# EasyEDA Pro project 主驱一体(省高校).epro

# Schematic Schematic4_1
Create Date: 2024-09-04; Page Name: P1; Project Name: 麦轮小车主控板; Schematic Name: Schematic4_1; Update Date: 2024-09-04; Company: 嘉立创EDA; Page Size: A4; Version: V1.0
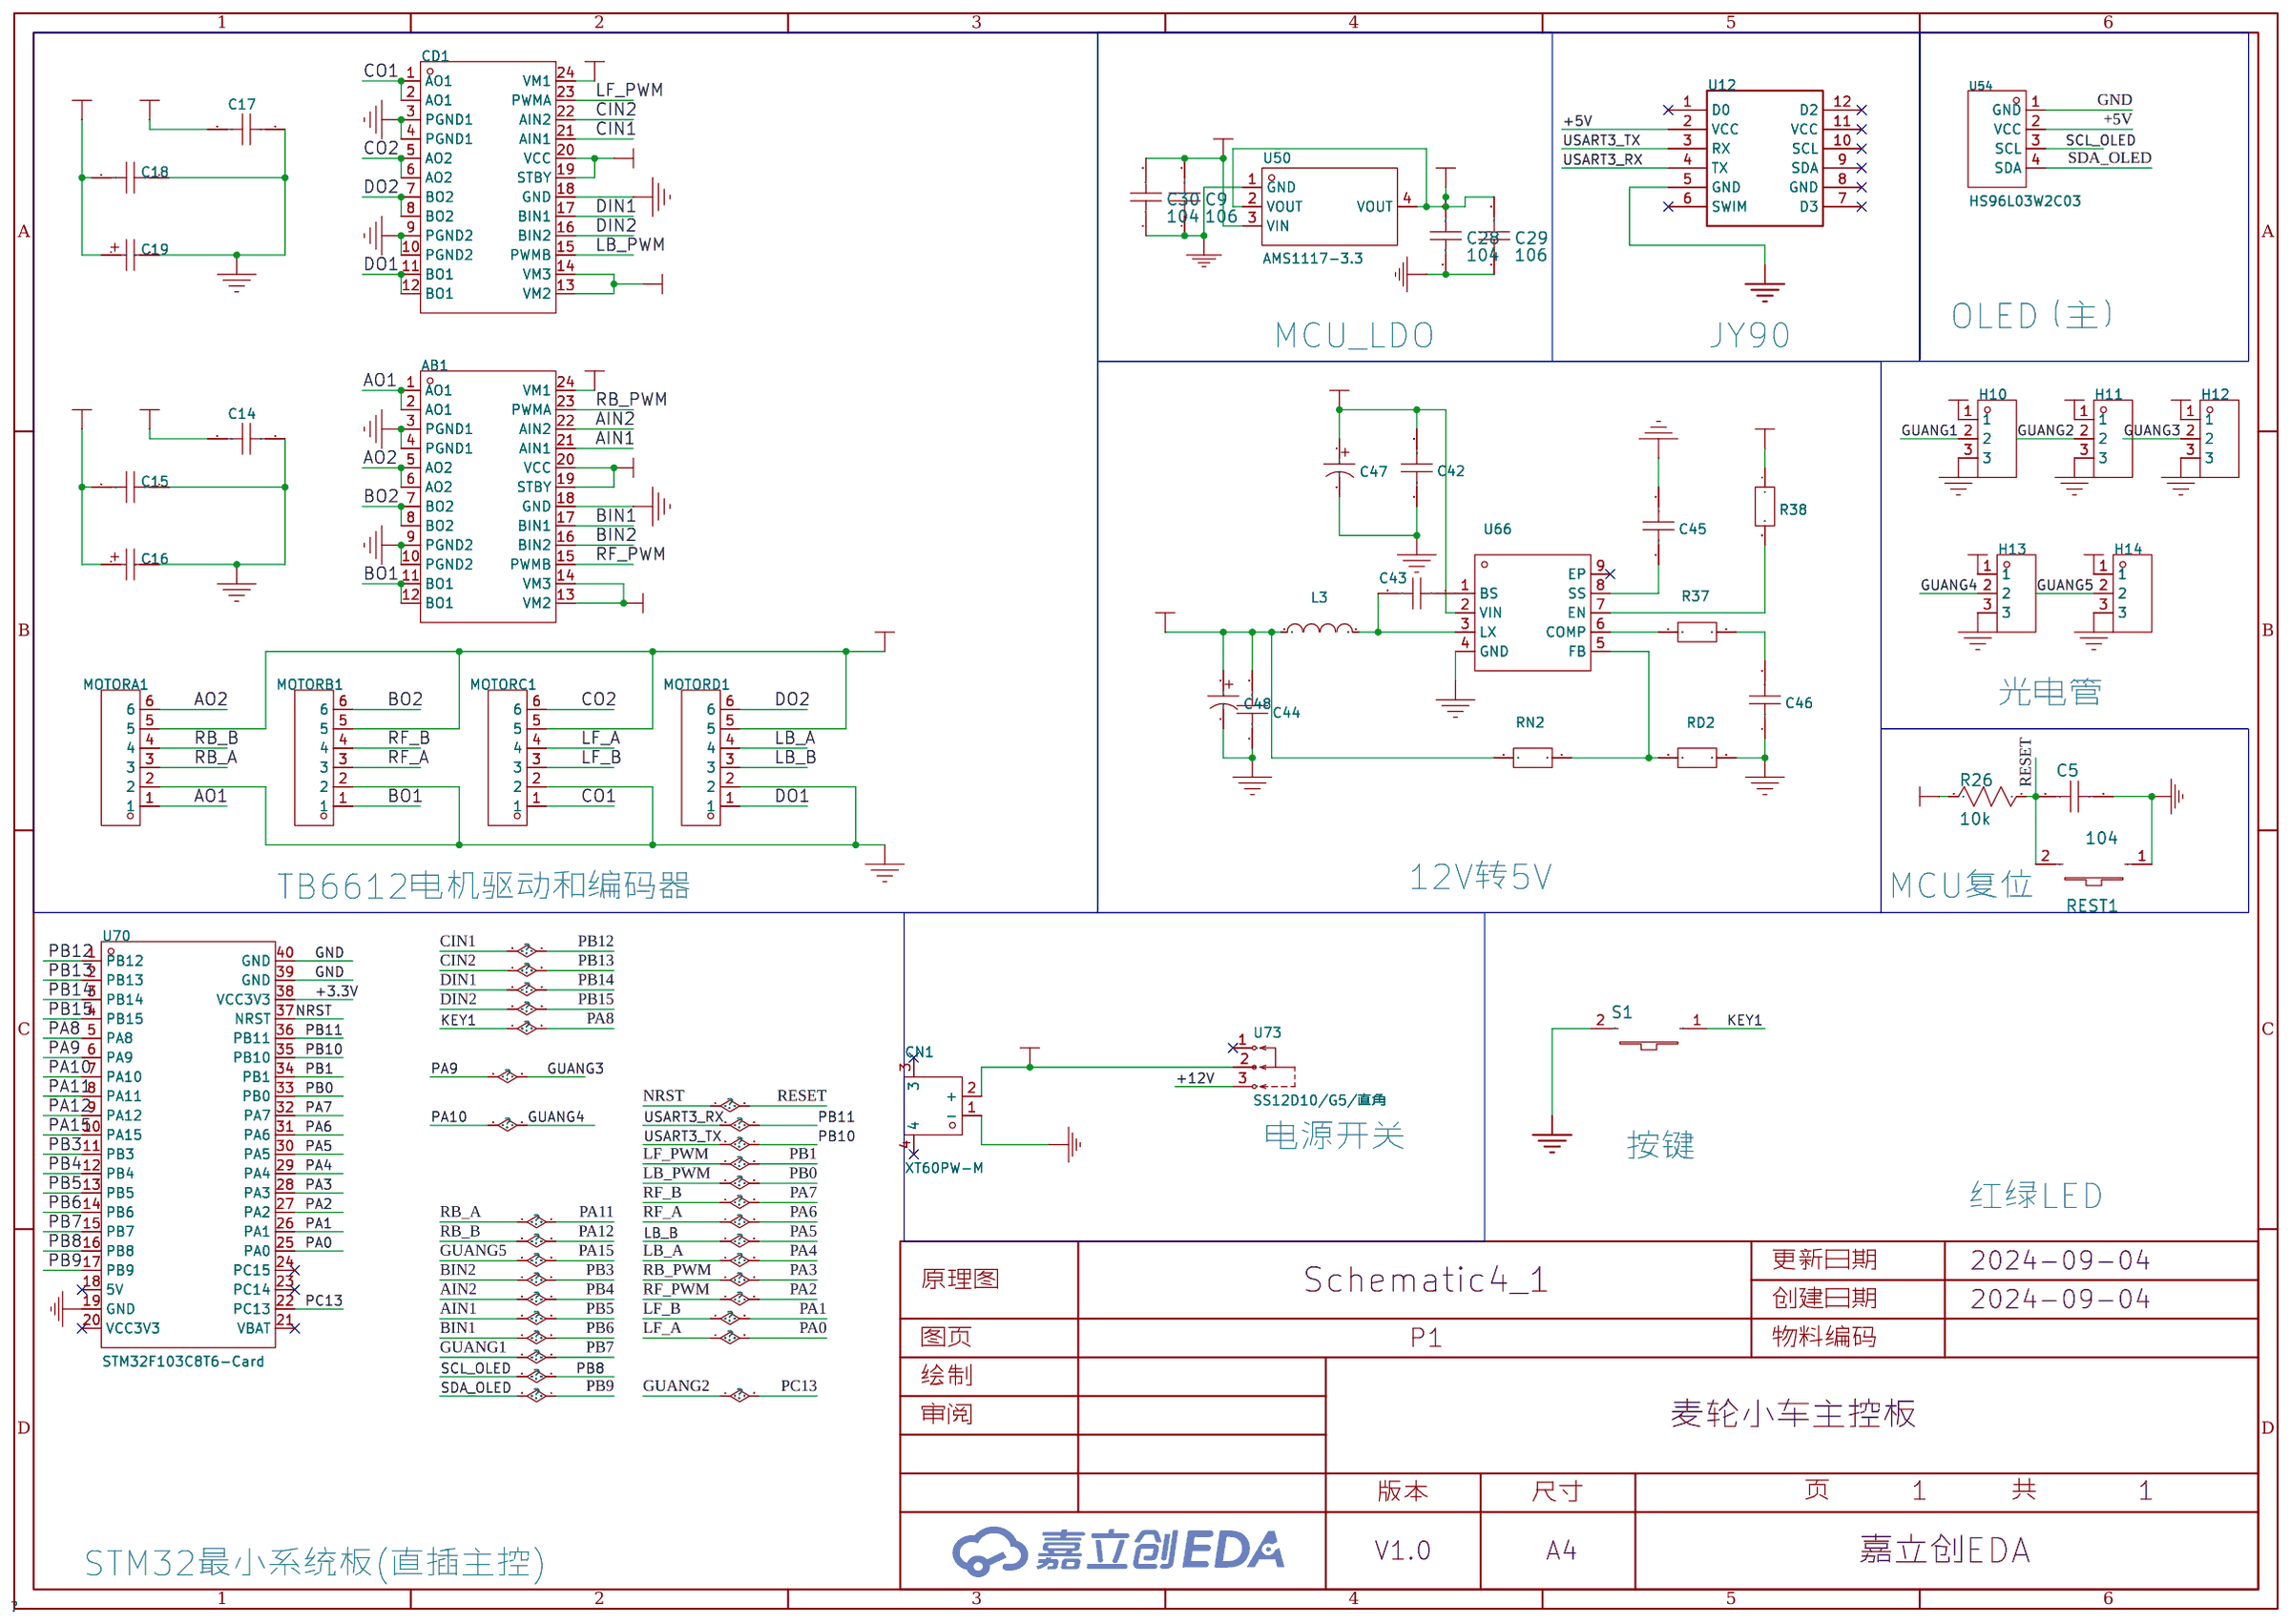
[diagram p0: schematic sheet]

## Parts
AB1  TB6612FNG(O,C,8,EL  [SSOP-24_L8.4-W5.8-P0.65-LS7.8-BL]
C5  104  [c0805]
C9  106  [c0805]
C14  100nF  [C0603]
C15  100nF  [C0603]
C16  10uF  [CAP-SMD_L3.5-W2.8-R-RD]
C17  100nF  [C0603]
C18  100nF  [C0603]
C19  10uF  [CAP-SMD_L3.5-W2.8-R-RD]
C28  104  [c0805]
C29  106  [c0805]
C30  104  [c0805]
C42  0.1uF  [c0805]
C43  10nF  [c0805]
C44  0.1uF  [c0805]
C45  0.1uF  [c0805]
C46  1.5nF  [c0805]
C47  100uF  [cap-smd_bd6.3-l6.6-w6.6-fd]
C48  100uF  [cap-smd_bd6.3-l6.6-w6.6-fd]
CD1  TB6612FNG(O,C,8,EL  [SSOP-24_L8.4-W5.8-P0.65-LS7.8-BL]
CN1  XT60PW-M  [CONN-TH_XT60PW-M]
H10  -  [HDR-TH_3P-P2.54-V-F]
H11  -  [HDR-TH_3P-P2.54-V-F]
H12  -  [HDR-TH_3P-P2.54-V-F]
H13  -  [HDR-TH_3P-P2.54-V-F]
H14  -  [HDR-TH_3P-P2.54-V-F]
L3  10uH  [ind-smd_l6.6-w6.6_mcw-06xx]
MOTORA1  X8821WR-06S-N0SN  [CONN-TH_6P-P2.50_X8821WR-06S-N2SN]
MOTORB1  X8821WR-06S-N0SN  [CONN-TH_6P-P2.50_X8821WR-06S-N2SN]
MOTORC1  X8821WR-06S-N0SN  [CONN-TH_6P-P2.50_X8821WR-06S-N2SN]
MOTORD1  X8821WR-06S-N0SN  [CONN-TH_6P-P2.50_X8821WR-06S-N2SN]
R26  10k  [r0805]
R37  5k  [r0805]
R38  100k  [r0805]
RD2  9.1k  [r0805]
REST1  Switch3x4x2  [KEY-SMD_2P-L6.2-W3.6-LS8.0]
RN2  39k  [r0805]
S1  Switch3x4x2  [KEY-SMD_2P-L6.2-W3.6-LS8.0]
U12  MPU6050(JY6X)  [维特陀螺仪]
U50  AMS1117-3.3  [SOT-223-3_L6.5-W3.4-P2.30-LS7.0-BR]
U54  HS96L03W2C03  [OLED-TH_L27.8-W27.2-P2.54_C9900033791]
U66  APW7301KAI-TRG  [sop-8_l4.9-w3.9-p1.27-ls6.0-bl-ep]
U70  STM32F103C8T6-Card  [CONN-TH_L53.3-W22.9_STM32F103C8T6-CARD]
U73  SS12D10/G5/直角  [SW-TH_SHOU-HAN_SS12D10G4]

## Library data of the parts
AB1 CD1 = TB6612FNG(O,C,8,EL: 双直流电机驱动器集成电路; Supplier Part: C88224; Manufacturer: TOSHIBA(东芝); Supplier Footprint: SSOP-24-208mil; JLCPCB Part Class: 扩展库; Datasheet: https://atta.szlcsc.com/upload/public/pdf/source/20171128/C141517_15118625624231147036.pdf; Supplier: LCSC
C5 C28 C30 = 104
C9 = 105
C14 C15 C17 C18 = 100nF: 容值:100nF;精度:±10%;额定电压:50V;材质(温度系数):X7R;; Supplier: LCSC; Manufacturer: SAMSUNG(三星); Manufacturer Part: CL10B104KB8NNNC; Supplier Part: C1591; JLCPCB Part Class: 扩展库; LCSC Part Name: 100nF ±10% 50V; Supplier Footprint: 0603; Datasheet: https://atta.szlcsc.com/upload/public/pdf/source/20160218/1457707763339.pdf; Tolerance: ±10%; Voltage Rated: 50V; Temperature Coefficient: X7R; Origin Footprint 1: CL10B104KB8NNNC
C16 C19 = 10uF: 容值:10uF;精度:±10%;额定电压:25V;等效串联电阻:2.5Ω@100kHz;; LCSC Part Name: 10uF ±10% 25V; Supplier Part: C7194; Manufacturer: Kyocera AVX; Manufacturer Part: TAJB106K025RNJ; Supplier Footprint: CASE-B-3528; JLCPCB Part Class: 扩展库; Datasheet: https://atta.szlcsc.com/upload/public/pdf/source/20160107/1457707750344.pdf; Supplier: LCSC; Tolerance: ±10%; Rated Voltage: 25V; Equivalent Series Resistance(ESR): 2.5Ω@100kHz; Operating Temperature: -55℃~+125℃; Origin Footprint 1: TAJB106K025RNJ
C29 = 106
C42 C44 C45 = 0.1uF: Supplier Part: C49678; Supplier: LCSC; Manufacturer Part: CC0805KRX7R9BB104; Manufacturer: YAGEO
C43 = 10nF: Supplier Part: C83170; Supplier: LCSC; Manufacturer Part: CC0805KRX7R9BB103; Manufacturer: YAGEO
C46 = 1.5nF: Supplier Part: C282745; Supplier: LCSC; Manufacturer Part: TCC0805X7R152K500DT; Manufacturer: CCTC
C47 C48 = 100uF: Supplier: LCSC; Manufacturer: ROQANG; Manufacturer Part: RVT1E101M0607; Supplier Part: C72477
CN1 = XT60PW-M: 类别:-;类型1:-;; LCSC Part Name: AMASS(艾迈斯)航模插头xt60连接器150公母对接pw锂电池公头 板插卧式XT60PW-M; Supplier Part: C98732; Manufacturer: AMASS(艾迈斯); JLCPCB Part Class: 扩展库; Datasheet: https://atta.szlcsc.com/upload/public/pdf/source/20240118/44A3DCFF53BE25DC65378AFFB21277A4.pdf; Supplier: LCSC; Brand: 艾迈斯; Type: 卧式插头; Colour: 黄色; InterfaceType: 公头
H10-H14 = HDR-F_2.54_1x3P: Supplier Part: C541850; Supplier Footprint: 插件
L3 = 10uH: Supplier: LCSC; Manufacturer: Hk-hotline; Manufacturer Part: MCW-0630-100-N2; Supplier Part: C169308
MOTORA1 MOTORB1 MOTORC1 MOTORD1 = X8821WR-06S-N0SN: 插针结构:1x6P;间距:2.5mm;安装方式:弯插;参考系列:XH;总PIN数:6P;排数:1;每排PIN数:6;行距:-;额定电流:3A;触头材质:黄铜;触头镀层:锡;工作温度范围:-;; LCSC Part Name: 1x6P 间距:2.5mm 弯插 系列:XH; Supplier Part: C388743; Manufacturer: XKB Connection(中国星坤); Supplier Footprint: 弯插,P=2.54mm; JLCPCB Part Class: 扩展库; Datasheet: https://atta.szlcsc.com/upload/public/pdf/source/20211009/984C14C41D2B1156BCF8EEF5D296E395.pdf; Supplier: LCSC; Pins Structure: 1x6P; Pitch: 2.5mm; Mounting Style: 弯插; Reference Series: XH; Number of Pins: 6P; Number of Rows: 1; Number of PINs Per Row: 6; Current Rating (Max): 3A; Contact Material: 黄铜; Contact Plating: 锡
R26 = 10k
R37 = 5k: Supplier Part: C332873; Supplier: LCSC; Manufacturer Part: RTT055001FTP; Manufacturer: RALEC
R38 = 100k: Supplier Part: C118847; Supplier: LCSC; Manufacturer Part: RS-05K1003FT; Manufacturer: FH
RD2 = 9.1k: Supplier Part: C286615; Supplier: LCSC; Manufacturer Part: RS-05K9101FT; Manufacturer: Guangdong Fenghua Advanced Tech
REST1 S1 = Switch3x4x2: Supplier: LCSC; Manufacturer: ReliaPro; Supplier Part: C26638
RN2 = 39k: Supplier Part: C25826; Supplier: LCSC; Manufacturer Part: 0805W8F3902T5E; Manufacturer: UniOhm
U12 = 维特陀螺仪
U50 = AMS1117-3.3_C6186: 输出类型:固定;输出极性:正;输出通道数:1;最大输入电压:-;输出电压:3.3V;压差:1.3V@(800mA);静态电流(地电流):-;输出电流:1A;电源纹波抑制比(PSRR):72dB@(120Hz);噪声:-;特性:-;工作温度:-;; LCSC Part Name: 正 Vout=3.3V 1A 72dB@(120Hz); Supplier Part: C6186; Manufacturer: AMS; Supplier Footprint: SOT-223-3; JLCPCB Part Class: 基础库; Datasheet: https://atta.szlcsc.com/upload/public/pdf/source/20180727/C6186_7A095716F0823C02F1997A905E26C086.pdf; Supplier: LCSC; Output Type: 固定; Output Polarity: 正; Number of Outputs: 1; Output Voltage: 3.3V; Dropout Voltage: 1.3V@(800mA); Output Current: 1A; Power Supply Rejection Ratio (PSRR): 72dB@(120Hz)
U54 = SPI-0.96OLED: 尺寸(inch)：0.96寸 0.96apos; 像素分辨率：128x64 128*64主控芯片：SSD1315 接口类型：I2C 外形:27.3*27.8；IIC/3SPI/4SPI串口通讯,工作温度范围-40℃—+70℃。4PIN黑底白光。; LCSC Part Name: 0.96寸OLED显示屏窄白光IIC; Supplier Part: C5248080; Manufacturer: HS(汉昇); JLCPCB Part Class: 扩展库; Datasheet: https://atta.szlcsc.com/upload/public/pdf/source/20230627/763D01F79A90007632F098068C7C8AD9.pdf; Supplier: LCSC
U66 = APW7301KAI-TRG: Supplier: LCSC; Manufacturer: ANPEC; Supplier Part: C115136; JLCPCB Part Class: Extend
U70 = STM32F103C8T6-Card: Supplier Part: C9900077949; Supplier Footprint: 插件; JLCPCB Part Class: Extended Part; Supplier: LCSC
U73 = SS12D10/G5/直角: Supplier Part: C9900029541; Supplier Footprint: THrough hole; JLCPCB Part Class: 扩展库; Supplier: LCSC

## Nets
+3.3V: C28.2 C29.2 R26.2 U50.2(VOUT) U50.4(VOUT) U70.38(VCC3V3)
+5V: AB1.19(STBY) AB1.20(VCC) C9.2 C14.2 C17.2 C30.2 C44.2 C48.1 CD1.19(STBY) CD1.20(VCC) H10.1 H11.1 H12.1 H13.1 H14.1 L3.1 MOTORA1.5 MOTORB1.5 MOTORC1.5 MOTORD1.5 RN2.2 U12.2(VCC) U50.3(VIN) U54.2(VCC)
+12V: AB1.13(VM2) AB1.14(VM3) AB1.24(VM1) C15.2 C16.1 C18.2 C19.1 C42.2 C47.1 CD1.13(VM2) CD1.14(VM3) CD1.24(VM1) R38.1 U66.2(VIN) U73.3
GND: AB1.3(PGND1) AB1.4(PGND1) AB1.9(PGND2) AB1.10(PGND2) AB1.18(GND) C5.1 C9.1 C14.1 C15.1 C16.2 C17.1 C18.1 C19.2 C28.1 C29.1 C30.1 C42.1 C44.1 C45.2 C46.1 C47.2 C48.2 CD1.3(PGND1) CD1.4(PGND1) CD1.9(PGND2) CD1.10(PGND2) CD1.18(GND) CN1.1(-) H10.3 H11.3 H12.3 H13.3 H14.3 MOTORA1.2 MOTORB1.2 MOTORC1.2 MOTORD1.2 RD2.2 REST1.1 S1.2 U12.5(GND) U50.1(GND) U54.1(GND) U66.4(GND) U70.19(GND) U70.39(GND) U70.40(GND)
VCC: CN1.2(+) U73.2
AIN1: AB1.21(AIN1) U70.13(PB5)
AIN2: AB1.22(AIN2) U70.12(PB4)
AO1: AB1.1(AO1) AB1.2(AO1) MOTORA1.1
AO2: AB1.5(AO2) AB1.6(AO2) MOTORA1.6
BIN1: AB1.17(BIN1) U70.14(PB6)
BIN2: AB1.16(BIN2) U70.11(PB3)
BO1: AB1.11(BO1) AB1.12(BO1) MOTORB1.1
BO2: AB1.7(BO2) AB1.8(BO2) MOTORB1.6
CIN1: CD1.21(AIN1) U70.1(PB12)
CIN2: CD1.22(AIN2) U70.2(PB13)
CO1: CD1.1(AO1) CD1.2(AO1) MOTORC1.1
CO2: CD1.5(AO2) CD1.6(AO2) MOTORC1.6
DIN1: CD1.17(BIN1) U70.3(PB14)
DIN2: CD1.16(BIN2) U70.4(PB15)
DO1: CD1.11(BO1) CD1.12(BO1) MOTORD1.1
DO2: CD1.7(BO2) CD1.8(BO2) MOTORD1.6
GUANG1: H10.2 U70.15(PB7)
GUANG2: H11.2 U70.22(PC13)
GUANG3: H12.2 U70.6(PA9)
GUANG4: H13.2 U70.7(PA10)
GUANG5: H14.2 U70.10(PA15)
KEY1: S1.1 U70.5(PA8)
LB_A: MOTORD1.4 U70.29(PA4)
LB_B: MOTORD1.3 U70.30(PA5)
LB_PWM: CD1.15(PWMB) U70.33(PB0)
LF_A: MOTORC1.4 U70.25(PA0)
LF_B: MOTORC1.3 U70.26(PA1)
LF_PWM: CD1.23(PWMA) U70.34(PB1)
NRST: C5.2 R26.1 REST1.2 U70.37(NRST)
PA2: AB1.15(PWMB) U70.27(PA2)
PA3: AB1.23(PWMA) U70.28(PA3)
PA6: MOTORB1.3 U70.31(PA6)
PA7: MOTORB1.4 U70.32(PA7)
PA11: MOTORA1.3 U70.8(PA11)
PA12: MOTORA1.4 U70.9(PA12)
PB8: U54.3(SCL) U70.16(PB8)
PB9: U54.4(SDA) U70.17(PB9)
PB10: U12.3(RX) U70.35(PB10)
PB11: U12.4(TX) U70.36(PB11)
$1N6371: C43.2 L3.2 U66.3(LX)
$1N6375: C43.1 U66.1(BS)
$1N6383: RD2.1 RN2.1 U66.5(FB)
$1N6390: C45.1 U66.8(SS)
$1N6393: R37.2 U66.6(COMP)
$1N6395: C46.2 R37.1
$1N6398: R38.2 U66.7(EN)

Not connected (* = marked no-connect by the designer): CN1 3* 4*; U12 1(D0)* 6(SWIM)* 7(D3)* 8(GND)* 9(SDA)* 10(SCL)* 11(VCC)* 12(D2)*; U66 9(EP)*; U70 18(5V)* 20(VCC3V3)* 21(VBAT)* 23(PC14)* 24(PC15)*; U73 1*

## Notes on the sheet
- OLED（主）
- MCU_LDO
- JY90
- 光电管
- MCU复位
- TB6612电机驱动和编码器
- 12V转5V
- 电源开关
- 按键
- 红绿LED
- STM32最小系统板(直插主控)

# Board PCB23_1
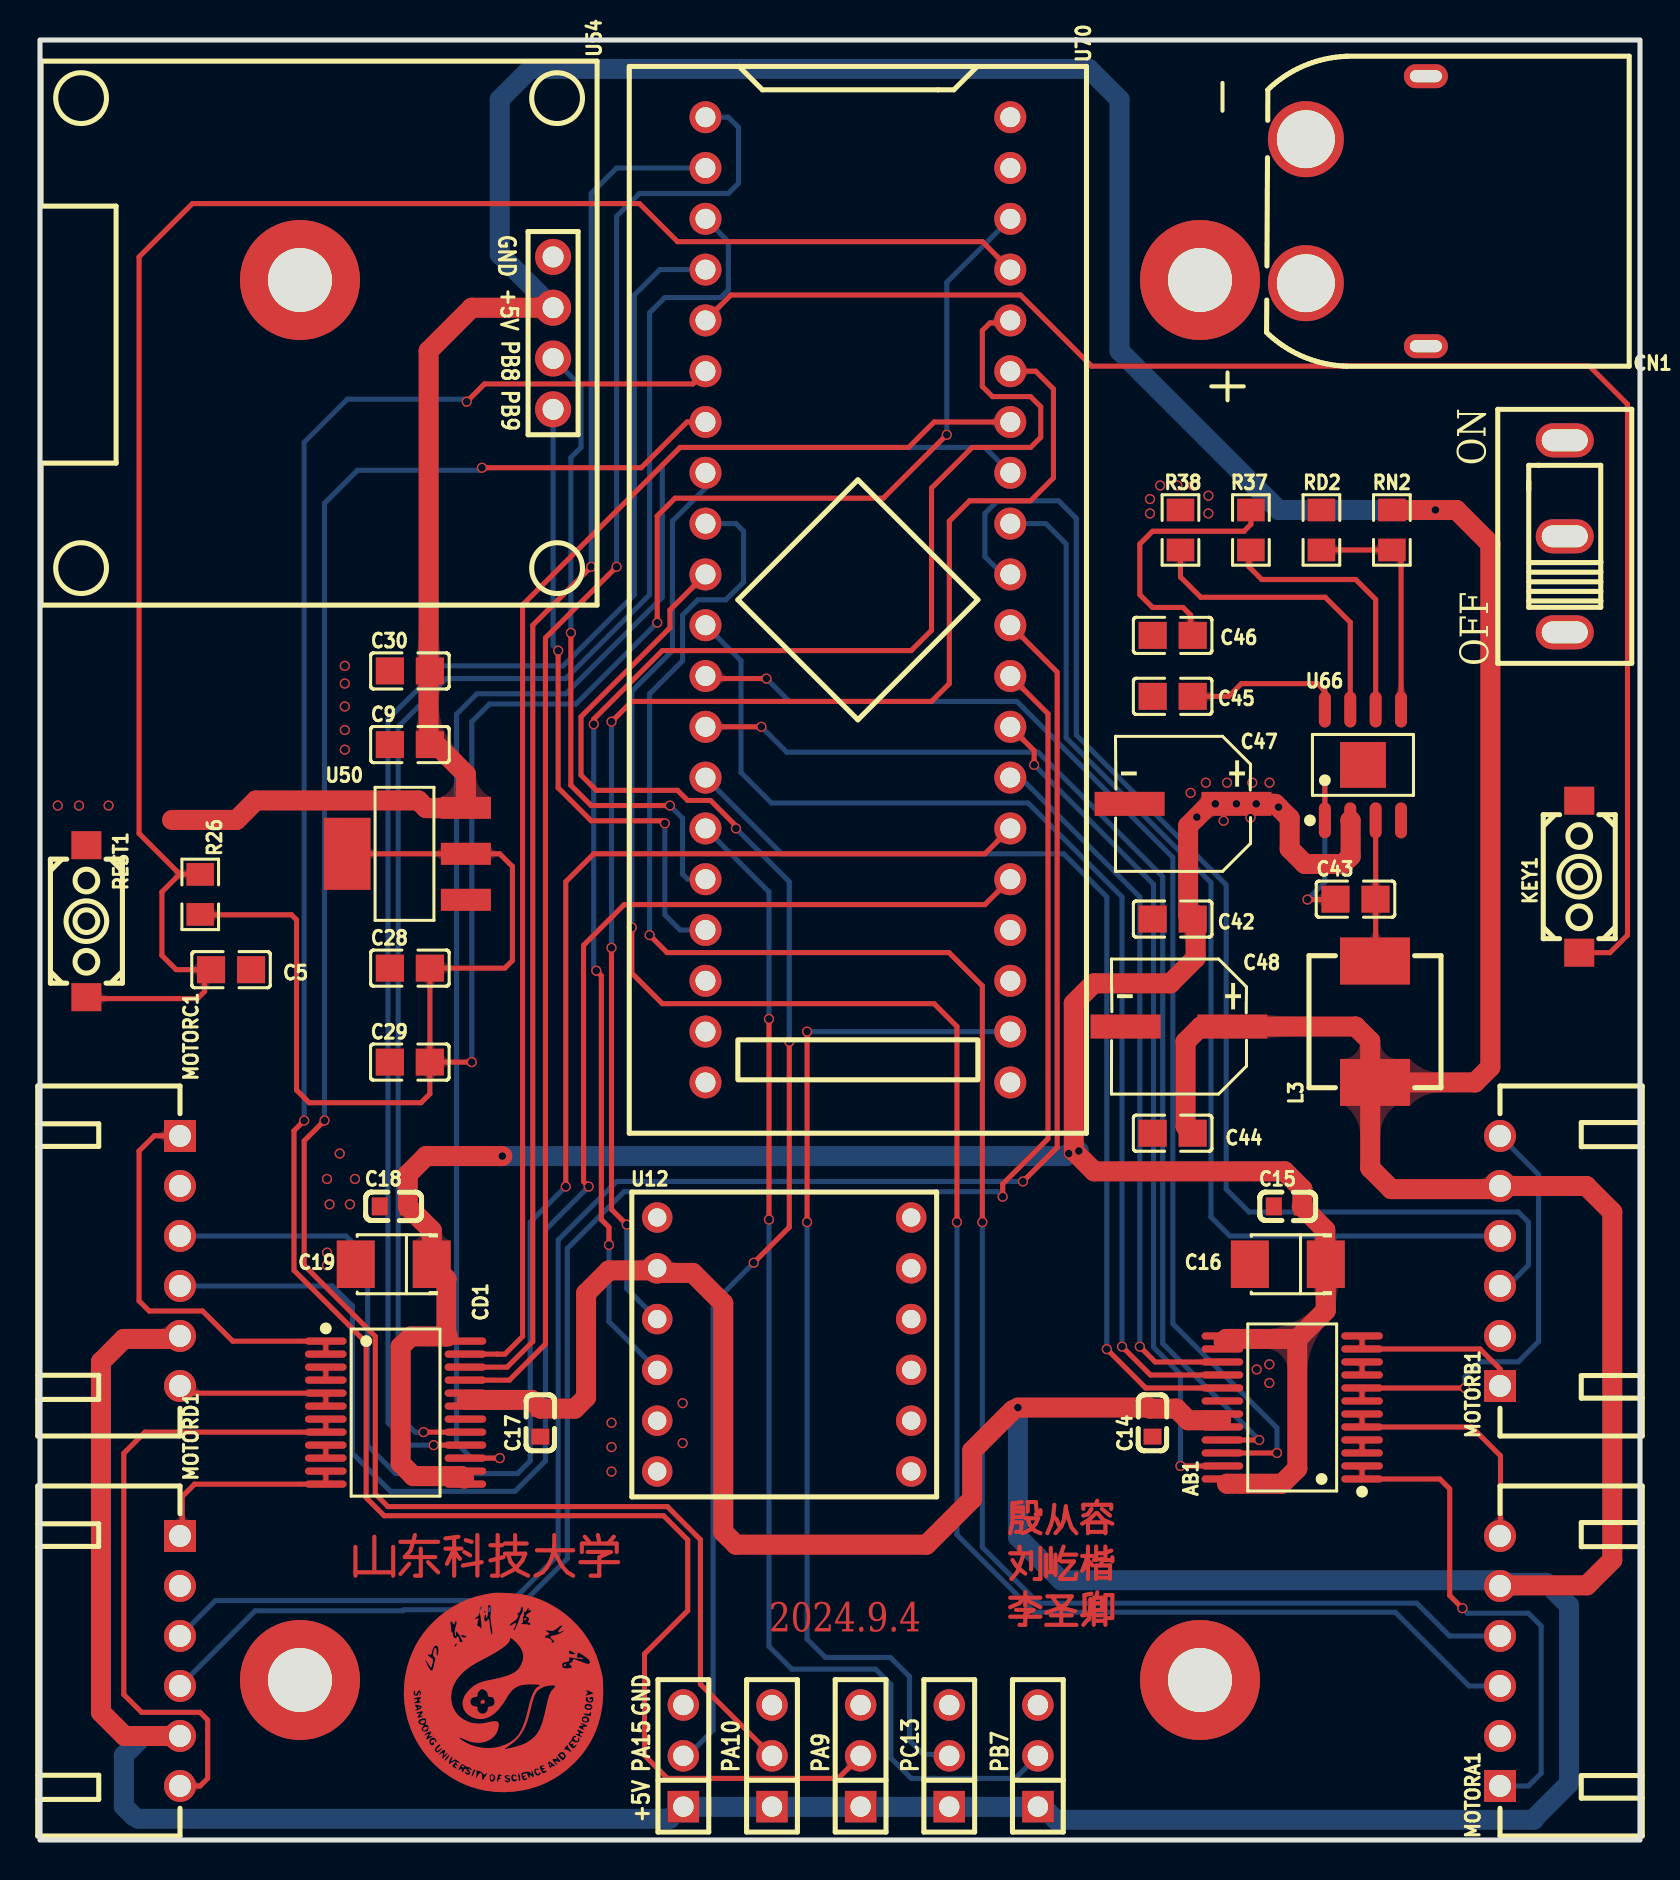
[diagram p1: board, top side]
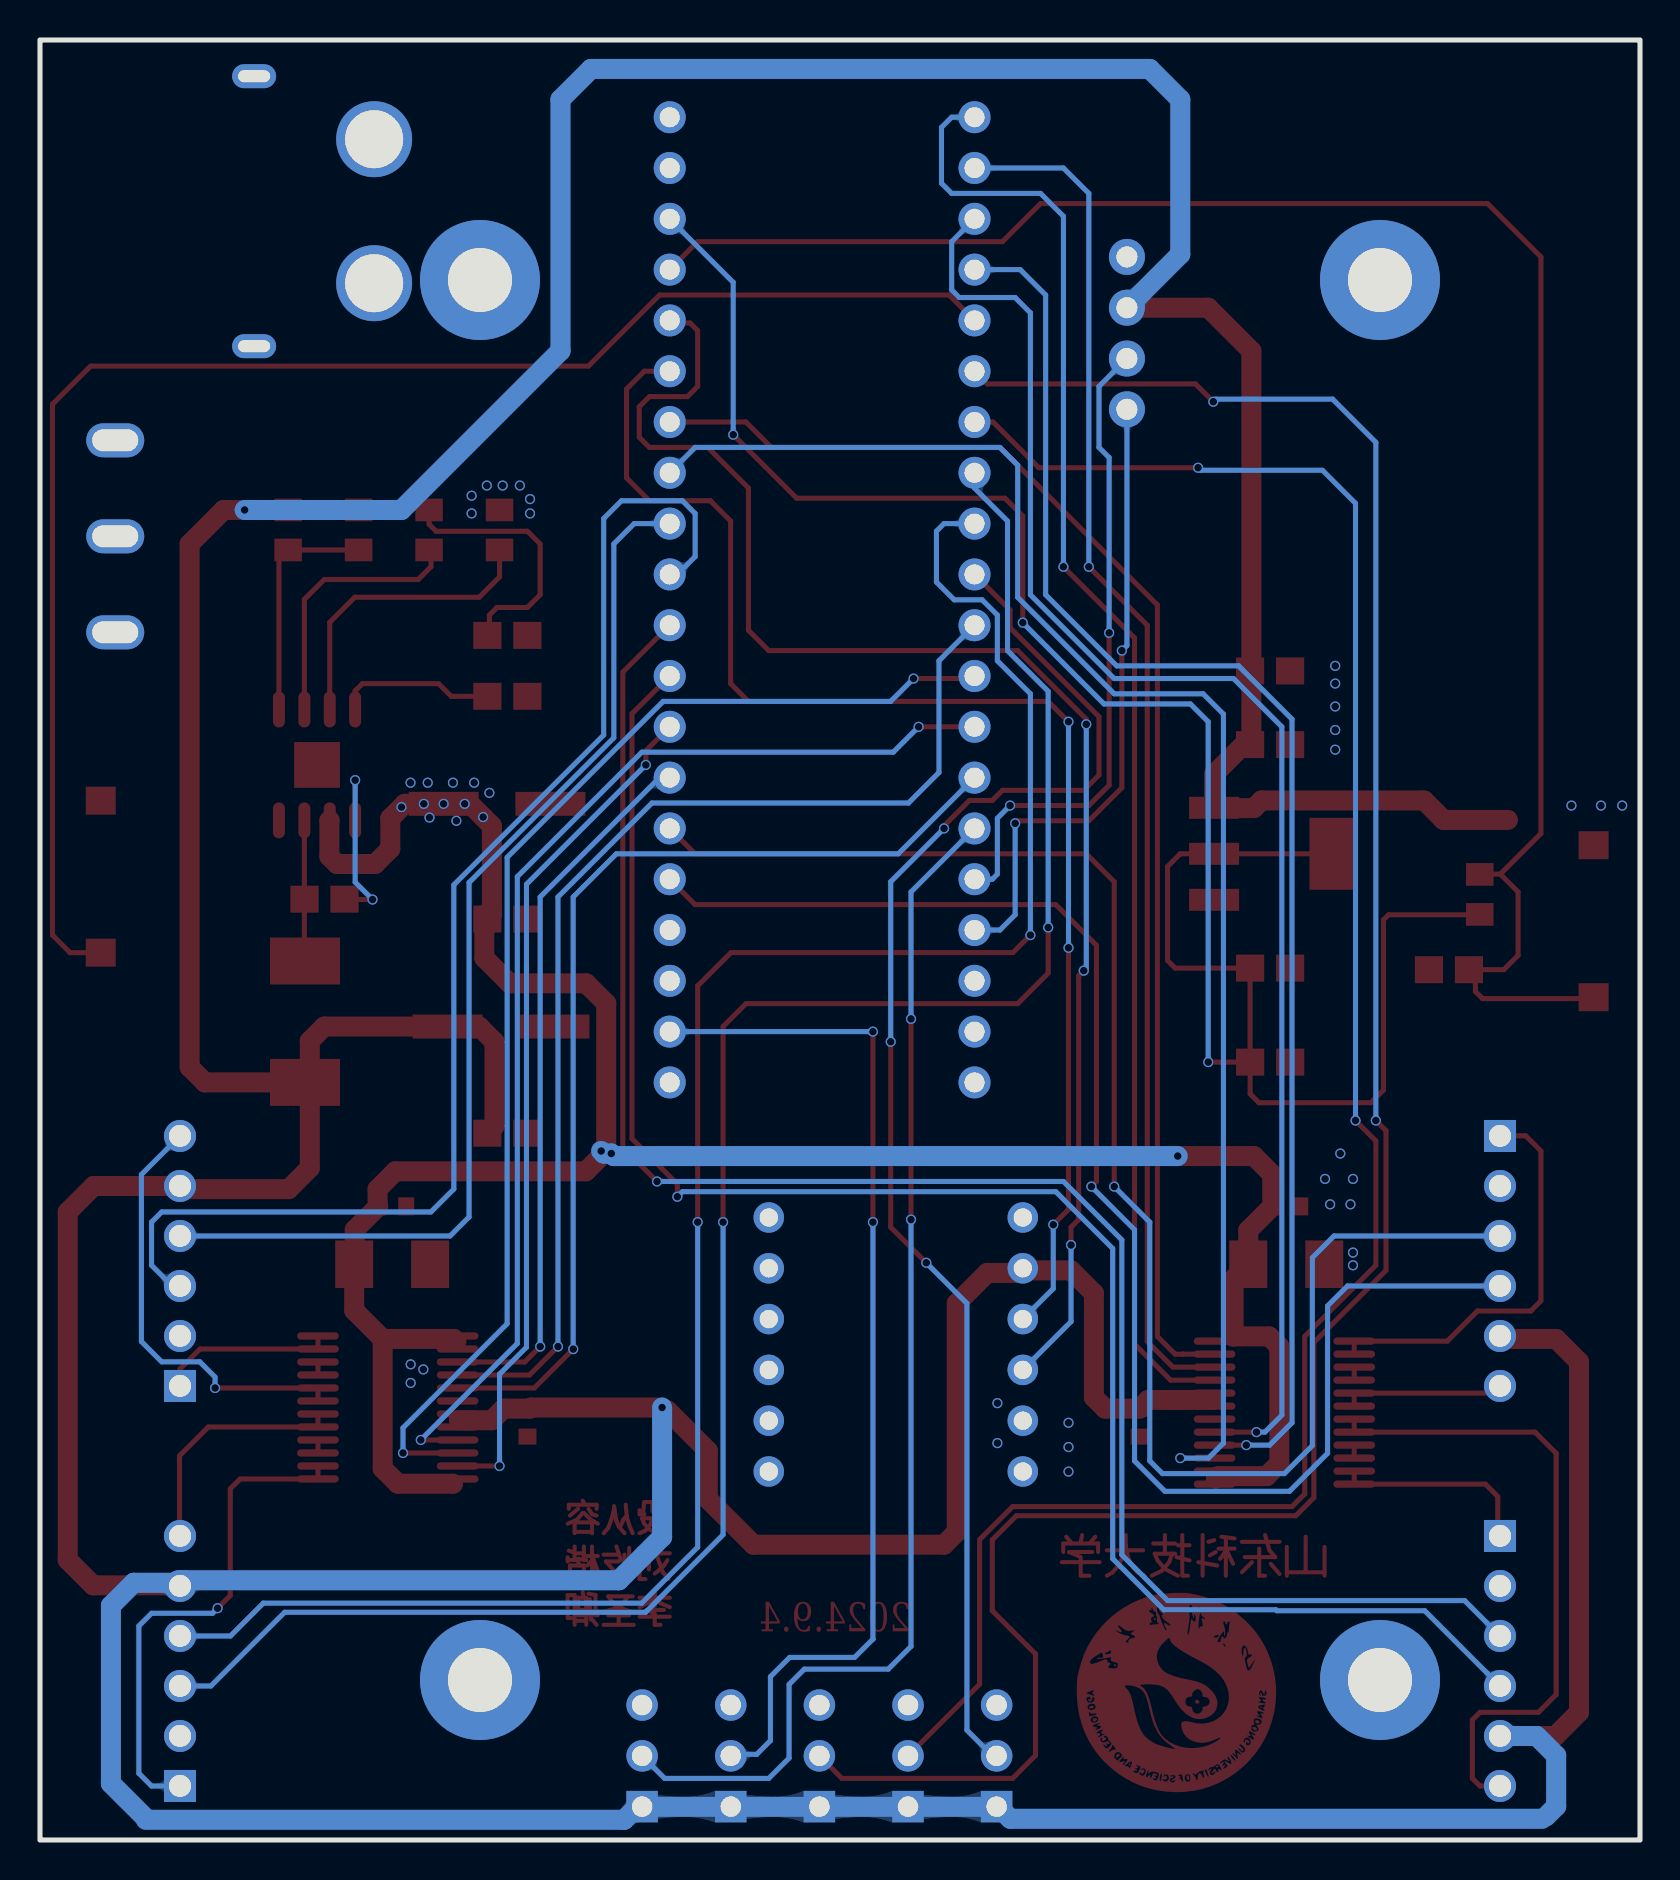
[diagram p2: board, bottom side, seen from below]

Outline 80 x 90 mm; copper layers: Top Layer, Bottom Layer. Coordinates in mm from the lower left corner of the outline.
Outline path: rectangle 0,90 80,0
Stack: Top Layer 0.035mm / Dielectric1 1.51mm FR4 er 4.5 / Bottom Layer 0.035mm

## Design rules (mm)
template: 用户自定义配置
spacing safeClearance (default): track to track 0.203, other pairs 0.152 to 0.3
track width trackWidth (default): min 0.254, default 0.254, max 2.54
differential pair differentialPair (default): width min 0.127, default 0.254, max 2.54; gap min 0.152, default 0.152
via viaSize (default): diameter min 0.5, default 0.508, max 10; hole min 0.3, default 0.381, max 5.999

## Placement (name value [footprint] x y rotation side)
AB1  TB6612FNG(O,C,8,EL  [SSOP-24_L8.4-W5.8-P0.65-LS7.8-BL]  62.61 21.63 90 top
C5  104  [c0805]  9.55 43.52 180 top
C9  106  [c0805]  18.5 54.77 0 top
C14  100nF  [C0603]  55.63 20.87 90 top
C15  100nF  [C0603]  62.39 31.68 0 top
C16  10uF  [CAP-SMD_L3.5-W2.8-R-RD]  62.39 28.79 0 top
C17  100nF  [C0603]  25.02 20.87 90 top
C18  100nF  [C0603]  17.69 31.68 0 top
C19  10uF  [CAP-SMD_L3.5-W2.8-R-RD]  17.69 28.79 0 top
C28  104  [c0805]  18.5 43.59 0 top
C29  106  [c0805]  18.49 38.89 0 top
C30  104  [c0805]  18.5 58.45 0 top
C42  0.1uF  [c0805]  56.63 46.05 0 top
C43  10nF  [c0805]  65.78 47.04 0 top
C44  0.1uF  [c0805]  56.63 35.34 0 top
C45  0.1uF  [c0805]  56.63 57.18 180 top
C46  1.5nF  [c0805]  56.63 60.23 0 top
C47  100uF  [cap-smd_bd6.3-l6.6-w6.6-fd]  57.15 51.81 180 top
C48  100uF  [cap-smd_bd6.3-l6.6-w6.6-fd]  56.95 40.67 180 top
CD1  TB6612FNG(O,C,8,EL  [SSOP-24_L8.4-W5.8-P0.65-LS7.8-BL]  17.78 21.37 270 top
CN1  XT60PW-M  [CONN-TH_XT60PW-M]  66.29 81.44 180 top
H10  -  [HDR-TH_3P-P2.54-V-F]  49.89 4.21 90 top
H11  -  [HDR-TH_3P-P2.54-V-F]  45.46 4.21 90 top
H12  -  [HDR-TH_3P-P2.54-V-F]  41.03 4.21 90 top
H13  -  [HDR-TH_3P-P2.54-V-F]  36.6 4.21 90 top
H14  -  [HDR-TH_3P-P2.54-V-F]  32.17 4.21 90 top
KEY1  Switch3x4x2  [KEY-SMD_2P-L6.2-W3.6-LS8.0]  76.96 48.17 90 top
L3  10uH  [ind-smd_l6.6-w6.6_mcw-06xx]  66.75 40.92 90 top
MOTORA1  X8821WR-06S-N0SN  [CONN-TH_6P-P2.50_X8821WR-06S-N2SN]  73 8.95 90 top
MOTORB1  X8821WR-06S-N0SN  [CONN-TH_6P-P2.50_X8821WR-06S-N2SN]  73 28.95 90 top
MOTORC1  X8821WR-06S-N0SN  [CONN-TH_6P-P2.50_X8821WR-06S-N2SN]  7 28.95 270 top
MOTORD1  X8821WR-06S-N0SN  [CONN-TH_6P-P2.50_X8821WR-06S-N2SN]  7 8.95 270 top
NOREF  -  [Pad_ie51]  58 8 0 top
NOREF#2  -  [Pad_ie48]  13 78 0 top
NOREF#3  -  [Pad_ie49]  58 78 0 top
NOREF#4  -  [Pad_ie50]  13 8 0 top
R26  10k  [r0805]  8.01 47.28 270 top
R37  5k  [r0805]  60.55 65.5 270 top
R38  100k  [r0805]  57.02 65.5 270 top
RD2  9.1k  [r0805]  64.07 65.5 90 top
REST1  Switch3x4x2  [KEY-SMD_2P-L6.2-W3.6-LS8.0]  2.32 45.94 270 top
RN2  39k  [r0805]  67.59 65.5 90 top
U12  MPU6050(JY6X)  [维特陀螺仪]  30.86 31.13 0 top
U50  AMS1117-3.3  [SOT-223-3_L6.5-W3.4-P2.30-LS7.0-BR]  18.33 49.31 0 top
U54  HS96L03W2C03  [OLED-TH_L27.8-W27.2-P2.54_C9900033791]  25.65 75.34 270 top
U66  APW7301KAI-TRG  [sop-8_l4.9-w3.9-p1.27-ls6.0-bl-ep]  66.15 53.75 0 top
U70  STM32F103C8T6-Card  [CONN-TH_L53.3-W22.9_STM32F103C8T6-CARD]  40.89 62.01 270 top
U73  SS12D10/G5/直角  [SW-TH_SHOU-HAN_SS12D10G4]  76.24 65.18 90 top

## Footprints (pads in the part's own frame, mm; a bottom-side part is the same pattern mirrored in y, then rotated)
C0603
  rect 0.8x0.9 smd: 1(-0.7,0) 2(0.7,0)
c0805
  rect 1.41x1.35 smd: 1(-1,0) 2(1,0)
cap-smd_bd6.3-l6.6-w6.6-fd
  rect 3.5x1.2 smd: 1(-2.67,0) 2(2.67,0)
CAP-SMD_L3.5-W2.8-R-RD
  rect 1.9x2.376 smd: 1(1.899,0) 2(-1.899,0)
CONN-TH_6P-P2.50_X8821WR-06S-N2SN
  rect 1.6x1.6 hole 1.1: 1(-6.25,0)
  round 1.6 hole 1.1: 2(-3.75,0) 3(-1.25,0) 4(1.25,0) 5(3.75,0) 6(6.25,0)
CONN-TH_L53.3-W22.9_STM32F103C8T6-CARD
  round 1.6 hole 1: 1(-24.13,-7.62) 2(-21.59,-7.62) 3(-19.05,-7.62) 4(-16.51,-7.62) 5(-13.97,-7.62) 6(-11.43,-7.62) 7(-8.89,-7.62) 8(-6.35,-7.62) 9(-3.81,-7.62) 10(-1.27,-7.62) 11(1.27,-7.62) 12(3.81,-7.62) 13(6.35,-7.62) 14(8.89,-7.62) 15(11.43,-7.62) 16(13.97,-7.62) 17(16.51,-7.62) 18(19.05,-7.62) 19(21.59,-7.62) 20(24.13,-7.62) 21(24.13,7.62) 22(21.59,7.62) 23(19.05,7.62) 24(16.51,7.62) 25(13.97,7.62) 26(11.43,7.62) 27(8.89,7.62) 28(6.35,7.62) 29(3.81,7.62) 30(1.27,7.62) 31(-1.27,7.62) 32(-3.81,7.62) 33(-6.35,7.62) 34(-8.89,7.62) 35(-11.43,7.62) 36(-13.97,7.62) 37(-16.51,7.62) 38(-19.05,7.62) 39(-21.59,7.62) 40(-24.13,7.62)
CONN-TH_XT60PW-M
  round 3.8 hole 2.9: 1(3,-3.6) 2(3,3.6)
  oval 2.2x1.2 hole 1.6x0.6: 3(-3,6.75) 4(-3,-6.75)
HDR-TH_3P-P2.54-V-F
  rect 1.575x1.575 hole 1.02: 1(-2.54,0)
  round 1.575 hole 1.02: 2(0,0) 3(2.54,0)
ind-smd_l6.6-w6.6_mcw-06xx
  rect 2.35x3.5 smd: 1(-3.035,0) 2(3.035,0)
KEY-SMD_2P-L6.2-W3.6-LS8.0
  rect 1.4x1.5 smd: 1(-3.8,0) 2(3.8,0)
OLED-TH_L27.8-W27.2-P2.54_C9900033791
  round 1.8 hole 1.05: 1(-3.81,0) 2(-1.27,0) 3(1.27,0) 4(3.81,0)
Pad_ie48
  round 6 hole 3.2: 0(0,0)
Pad_ie49
  round 6 hole 3.2: 0(0,0)
Pad_ie50
  round 6 hole 3.2: 0(0,0)
Pad_ie51
  round 6 hole 3.2: 0(0,0)
r0805
  rect 1.133x1.377 smd: 1(-1,0) 2(1,0)
sop-8_l4.9-w3.9-p1.27-ls6.0-bl-ep
  oval 0.6x1.8 smd: 1(-1.905,-2.772) 2(-0.635,-2.772) 3(0.635,-2.772) 4(1.905,-2.772) 5(1.905,2.772) 6(0.635,2.772) 7(-0.635,2.772) 8(-1.905,2.772)
  rect 2.29x2.29 smd: 9(0,0)
SOT-223-3_L6.5-W3.4-P2.30-LS7.0-BR
  rect 2.5x1.1 smd: 1(2.97,-2.3) 2(2.97,0) 3(2.97,2.3)
  rect 2.34x3.6 smd: 4(-2.97,0)
SSOP-24_L8.4-W5.8-P0.65-LS7.8-BL
  oval 0.364x2.082 smd: 1(-3.575,-3.491) 2(-2.925,-3.491) 3(-2.275,-3.491) 4(-1.625,-3.491) 5(-0.975,-3.491) 6(-0.325,-3.491) 7(0.325,-3.491) 8(0.975,-3.491) 9(1.625,-3.491) 10(2.275,-3.491) 11(2.925,-3.491) 12(3.575,-3.491) 13(3.575,3.491) 14(2.925,3.491) 15(2.275,3.491) 16(1.625,3.491) 17(0.975,3.491) 18(0.325,3.491) 19(-0.325,3.491) 20(-0.975,3.491) 21(-1.625,3.491) 22(-2.275,3.491) 23(-2.925,3.491) 24(-3.575,3.491)
SW-TH_SHOU-HAN_SS12D10G4
  oval 1.7x2.9 hole 1.1x2.3: 1(-4.8,0) 2(0,0) 3(4.8,0)
维特陀螺仪
  round 1.524 hole 0.914: 1(0,0) 2(0,-2.54) 3(0,-5.08) 4(0,-7.62) 5(0,-10.16) 6(0,-12.7) 7(12.7,-12.7) 8(12.7,-10.16) 9(12.7,-7.62) 10(12.7,-5.08) 11(12.7,-2.54) 12(12.7,0)

## Nets
As in the schematic, except:
GND: AB1.3 AB1.4 AB1.9 AB1.10 AB1.18 C5.1 C9.1 C14.1 C15.1 C16.2 C17.1 C18.1 C19.2 C28.1 C29.1 C30.1 C42.1 C44.1 C45.2 C46.1 C47.2 C48.2 CD1.3 CD1.4 CD1.9 CD1.10 CD1.18 CN1.1 H10.3 H11.3 H12.3 H13.3 H14.3 KEY1.2 MOTORA1.2 MOTORB1.2 MOTORC1.2 MOTORD1.2 RD2.2 REST1.1 U12.5 U50.1 U54.1 U66.4 U70.19 U70.39 U70.40
KEY1: KEY1.1 U70.5

Pads without a net: CN1 3 4; NOREF 0; NOREF#2 0; NOREF#3 0; NOREF#4 0; U12 1 6 7 8 9 10 11 12; U66 9; U70 18 20 21 23 24; U73 1

## Via types
v1: diameter 0.508, hole 0.381, Top Layer to Bottom Layer, 97 vias

## Routing (per net, layer and track width the routed paths; a pad name or vN(x,y) marks a point on that pad's centre or on a via; arc(x,y) is an arc through that point)
+3.3V: length 108.4
  Top Layer w0.254: C29.2 v1(21.59,38.89) ; C29.2 19.5,38.9 C28.2 23.24,43.59 23.62,43.97 23.62,48.67 22.99,49.31 U50.2 U50.4 ; C29.2 19.49,37.31 19.05,36.86 13.46,36.86 12.83,37.5 12.83,46.01 12.57,46.26 8.03,46.26 R26.2 ; v1(30.86,60.87) 30.86,66.2 31.75,67.09 42.16,67.09 v1(45.34,70.26)
  Bottom Layer w0.254: U70.38 45.34,77.88 v1(45.34,70.26) ; v1(30.86,60.87) 26.8,56.8 22.48,56.8 21.59,55.91 v1(21.59,38.89)
+5V: length 428.4
  Top Layer w1: C44.2 57.28,35.69 57.28,39.91 58.04,40.67 C48.1 65.79,40.67 66.51,39.95 66.51,38.12 ; 19.43,58.52 19.43,74.45 21.59,76.61 U54.2 ; 19.43,58.52 19.43,54.83 C9.2 ; 19.43,58.52 C30.2 ; RN2.2 v1(69.77,66.5) 70.82,66.5 72.52,64.8 72.52,38.64 71.75,37.88 66.75,37.88 ; MOTORC1.5 6.85,25.05 4.19,25.05 3.05,23.91 3.05,6.38 4.23,5.2 MOTORD1.5 ; MOTORA1.5 73.03,12.73 77.34,12.73 78.61,14 78.61,31.4 77.31,32.7 MOTORB1.5 72.84,32.55 67.56,32.55 66.51,33.6 66.51,38.12 ; 66.51,38.12 L3.1 ; 21.34,22 24.58,22 C17.2 26.74,21.57 27.31,22.13 27.31,27.34 28.45,28.48 30.76,28.48 U12.2 31.09,28.35 32.64,28.35 34.16,26.83 34.16,15.4 34.8,14.76 44.32,14.76 46.61,17.05 46.61,19.46 48.64,21.5 ; 19.56,55.02 21.3,53.29 U50.3 21.28,51.59 19.3,51.59 18.92,51.98 10.8,51.98 9.82,51 6.6,51 ; 59.06,20.99 57.4,20.99 56.82,21.57 55.5,21.57 55.45,21.62 v1(48.9,21.62)
  Bottom Layer w1: 74.67,1.04 76.45,2.83 76.45,11.72 75.31,12.86 73.16,12.86 MOTORA1.5 72.71,12.99 51.05,12.99 48.9,15.15 v1(48.9,21.62) ; 74.7,1.01 50.79,1.01 50.08,1.73 49.92,1.73 49.85,1.66 32.08,1.66 31.48,1.06 4.9,1.06 ; U54.2 22.99,79.28 22.99,87.03 24.51,88.55 52.45,88.55 53.97,87.03 53.97,74.45 61.93,66.5 v1(69.77,66.5) ; 4.7,1.18 4.19,1.68 4.19,4.22 5.17,5.2 MOTORD1.5
+12V: length 123.4
  Top Layer w1: U66.2 65.53,50.96 65.53,49.18 65.15,48.8 63.25,48.8 62.48,49.56 62.48,51.09 61.76,51.81 v1(60.81,51.81) v1(59.82,51.81) v1(58.77,51.81) 58.51,51.81 v1(57.84,51.15) 57.4,50.71 57.4,46.28 C42.2 ; 20.32,25.18 20.32,28.05 C19.1 19.59,30.48 C18.2 18.39,33.28 19.3,34.2 v1(23.11,34.2) ; 20.32,25.18 20.39,25.18 ; 20.32,25.18 18.54,25.18 18.03,24.67 18.03,18.83 18.67,18.19 21.08,18.19 21.21,18.07 ; 57.78,46.26 57.78,44.1 56.51,42.83 52.69,42.83 51.69,41.83 51.69,34.45 52.71,33.43 62.23,33.43 63.12,32.55 63.12,31.71 63.09,31.68 64.26,30.51 64.26,29.12 ; 62.87,25.05 59.31,25.05 59.18,24.92 ; 62.87,25.05 62.87,18.57 62.1,17.81 59.36,17.81 59.35,17.82 ; 62.87,25.05 64.29,26.48 C16.1
  Bottom Layer w1: v1(23.11,34.2) 51.31,34.2 v1(51.44,34.32) 51.82,34.32 v1(51.94,34.45)
  vias: v1(55.5,67.05) v1(55.5,66.33) v1(56.01,67.72) v1(56.87,67.72) v1(57.53,52.36) v1(57.66,67.72) v1(58.29,52.86) v1(58.42,67.22) v1(58.42,66.33) v1(59.18,50.96) v1(59.35,52.86) v1(60.53,51.12) v1(60.61,52.86) v1(61.47,52.86) v1(61.93,51.64)
GND: length 2.6
  Top Layer w0.254: CD1.10 CD1.9 ; AB1.9 66.1,23.9 ; CD1.4 CD1.3 ; AB1.3 AB1.4
  vias: v1(0.89,51.72) v1(1.95,51.72) v1(3.43,51.72) v1(14.35,33.05) v1(14.35,29.37) v1(14.35,28.73) v1(14.48,31.78) v1(14.99,34.32) v1(15.24,58.71) v1(15.24,57.82) v1(15.24,56.67) v1(15.24,55.5) v1(15.24,54.52) v1(15.49,31.78) v1(15.75,33.05) v1(28.57,20.86) v1(28.57,19.65) v1(28.57,18.42) v1(32.13,21.84) v1(32.13,19.84) v1(60.83,23.53) v1(61.47,23.78) v1(61.47,22.85)
AIN1: length 58
  Top Layer w0.254: v1(36.07,55.66) U70.13 ; AB1.21 v1(60.96,20)
  Bottom Layer w0.254: v1(60.96,20) 56.13,24.83 56.13,48.17 49.91,54.39 37.34,54.39 v1(36.07,55.66)
AIN2: length 61.8
  Top Layer w0.254: v1(36.32,58.07) 33.4,58.07 U70.12 ; AB1.22 v1(61.85,19.35)
  Bottom Layer w0.254: v1(61.85,19.35) 61.85,20.61 56.64,25.81 56.64,49.13 48.84,56.93 37.47,56.93 v1(36.32,58.07)
AO1: length 25.5
  Top Layer w0.254: AB1.2 AB1.1 69.99,18.05 70.49,17.56 70.49,12.22 v1(71.12,11.59)
  Bottom Layer w0.254: v1(71.12,11.59) 71.37,11.34 74.42,11.34 75.06,10.7 75.06,3.34 74.42,2.7 MOTORA1.1
AO2: length 12.2
  Top Layer w0.254: MOTORA1.6 73.03,15.23 73.03,19.21 71.58,20.65 AB1.5 66.1,21.3
BIN1: length 51.7
  Top Layer w0.254: AB1.17 55.28,22.6 v1(53.34,24.54)
  Bottom Layer w0.254: v1(53.34,24.54) 53.34,47.15 51.18,49.31 37.08,49.31 U70.14
BIN2: length 57.8
  Top Layer w0.254: v1(54.1,24.67) 55.52,23.25 AB1.16
  Bottom Layer w0.254: v1(54.1,24.67) 54.1,47.15 49.4,51.85 36.58,51.85 35.05,53.37 35.05,58.96 U70.11
BO1: length 8.8
  Top Layer w0.254: MOTORB1.1 73,23.55 72,24.55 AB1.11 66.1,25.2
BO2: length 21.8
  Top Layer w0.254: AB1.7 AB1.8 v1(71.25,22.6)
  Bottom Layer w0.254: v1(71.25,22.6) 71.25,23.15 72.01,23.91 73.91,23.91 74.93,24.92 74.93,33.27 MOTORB1.6
CIN1: length 74
  Top Layer w0.254: v1(28.83,63.66) 25.27,60.1 25.27,24.8 23.47,22.99 CD1.21
  Bottom Layer w0.254: v1(28.83,63.66) 28.83,81.19 29.97,82.33 34.42,82.33 34.93,82.84 34.93,85.63 34.42,86.14 33.27,86.14
CIN2: length 68.8
  Top Layer w0.254: v1(27.56,63.66) 24.64,60.74 24.64,24.92 23.36,23.64 CD1.22
  Bottom Layer w0.254: U70.2 28.83,83.6 27.56,82.33 v1(27.56,63.66)
CO1: length 20.7
  Top Layer w0.254: MOTORC1.1 6.99,35.21 5.72,35.21 4.95,34.45 4.95,26.96 5.46,26.45 8.13,26.45 9.63,24.94 CD1.1 CD1.2
CO2: length 8.1
  Top Layer w0.254: CD1.6 CD1.5 7.36,22.34 MOTORC1.6
DIN1: length 76.2
  Top Layer w0.254: CD1.17 v1(19.18,20.39)
  Bottom Layer w0.254: v1(19.18,20.39) 18.75,20.39 17.91,21.24 17.91,55.66 20.32,58.07 26.29,58.07 30.48,62.26 30.48,76.36 31.24,77.12 34.04,77.12 34.42,77.5 34.42,79.92 U70.3 33.15,80.93
DIN2: length 73.5
  Top Layer w0.254: CD1.16 v1(19.69,19.74)
  Bottom Layer w0.254: v1(19.69,19.74) 18.52,19.74 17.4,20.86 17.4,56.04 20.07,58.71 26.16,58.71 29.72,62.26 29.72,77.25 30.99,78.52 U70.4
DO1: length 10.1
  Top Layer w0.254: CD1.11 CD1.12 7.73,17.79 7.11,17.18 7.11,15.31 MOTORD1.1
DO2: length 32.4
  Top Layer w0.254: MOTORD1.6 8,2.7 8.38,3.08 8.38,6 8,6.38 5.08,6.38 4.19,7.27 4.19,19.34 5.25,20.39 CD1.8 CD1.7
GUANG1: length 61
  Top Layer w0.254: v1(36.45,31.02) v1(36.45,41.05)
  Bottom Layer w0.254: H10.2 48.77,3.08 43.56,3.08 42.54,4.1 42.54,7.78 41.78,8.54 37.59,8.54 36.45,9.68 v1(36.45,31.02) ; U70.15 36.45,47.4 v1(36.45,41.05)
GUANG2: length 52.1
  Top Layer w0.254: v1(38.35,30.89) v1(38.35,40.42)
  Bottom Layer w0.254: 38.35,10.04 39.27,9.13 42.52,9.13 43.48,8.17 43.48,4.97 44.16,4.28 45.23,4.28 ; 38.35,10.04 38.35,10.04 ; 38.35,10.04 v1(38.35,30.89) ; 45.23,4.28 45.34,4.17 ; 45.23,4.28 45.39,4.28 H11.2 ; v1(38.35,40.42) U70.22
GUANG3: length 116.5
  Top Layer w0.254: v1(21.34,71.92) 22.22,72.8 32.64,72.8 U70.6 ; H12.2 39.9,3.08 31.37,3.08 30.23,4.22 30.23,9.3 32.38,11.46 32.38,15.01 31.18,16.21 17.21,16.21 16.31,17.12 16.31,24.87 12.7,28.48 12.7,35.47 v1(13.21,35.97)
  Bottom Layer w0.254: v1(13.21,35.97) 13.21,69.88 15.37,72.04 21.21,72.04 v1(21.34,71.92)
GUANG4: length 101.7
  Top Layer w0.254: v1(14.22,35.97) 13.21,34.96 13.21,28.73 16.76,25.18 16.76,17.31 17.4,16.67 31.37,16.67 33.02,15.02 33.02,7.79 H13.2 ; U70.7 32.35,70.9 30.06,68.61 v1(22.1,68.61)
  Bottom Layer w0.254: v1(22.1,68.61) 21.97,68.49 15.88,68.49 14.22,66.83 v1(14.22,35.97)
GUANG5: length 71.3
  Top Layer w0.254: v1(35.69,28.86) 37.47,30.64 v1(37.47,39.91) ; v1(34.8,50.58) 34.8,50.71 33.53,51.98 32.38,51.98 31.88,52.48 27.81,52.48 27.05,53.25 27.05,56.17 31.5,60.61 31.5,61.5 U70.10
  Bottom Layer w0.254: H14.2 32.37,4.21 33.66,5.49 33.66,26.83 v1(35.69,28.86) ; v1(34.8,50.58) 37.47,47.91 v1(37.47,39.91)
KEY1: length 78.2
  Top Layer w0.254: U70.5 34.54,77.25 49.02,77.25 52.58,73.69 77.47,73.69 79.38,71.79 79.38,45.25 78.5,44.37 KEY1.1
LB_A: length 88.3
  Top Layer w0.254: U70.29 50.4,56.31 50.4,35.07 48.13,32.8 v1(48.13,32.16)
  Bottom Layer w0.254: v1(48.13,32.16) 47.88,32.42 29.21,32.42 26.37,29.57 26.37,14.07 23.81,11.51 18.21,11.51 18.16,11.46 10.76,11.46 MOTORD1.4
LB_B: length 90.3
  Top Layer w0.254: U70.30 50.86,58.39 50.86,34.64 v1(49.15,32.93)
  Bottom Layer w0.254: MOTORD1.3 8.77,11.97 23.62,11.97 25.91,14.26 25.91,30 28.83,32.93 v1(49.15,32.93)
LB_PWM: length 78.2
  Top Layer w0.254: CD1.15 v1(22.99,19.09)
  Bottom Layer w0.254: U70.33 47.24,69.63 32,69.63 31.12,68.74 31.12,62.14 26.29,57.31 21.84,57.31 20.83,56.29 20.83,19.84 21.58,19.09 v1(22.99,19.09)
LF_A: length 77
  Top Layer w0.254: U70.25 47.24,46.77 29.21,46.77 27.18,44.74 27.18,32.93 v1(27.43,32.67)
  Bottom Layer w0.254: MOTORC1.4 14.62,27.7 15.62,26.7 15.62,19.34 17.53,17.43 23.75,17.43 25.27,18.96 25.27,30.51 v1(27.43,32.67)
LF_B: length 81.2
  Top Layer w0.254: v1(26.29,32.67) 26.29,47.91 27.69,49.31 47.24,49.31 U70.26
  Bottom Layer w0.254: v1(26.29,32.67) 24.51,30.89 24.51,18.96 23.88,18.32 17.78,18.32 16.38,19.72 16.38,29.12 15.3,30.2 MOTORC1.3
LF_PWM: length 68
  Top Layer w0.254: U70.34 44.7,70.9 43.43,69.63 32,69.63 24.13,61.75 24.13,25.18 23.24,24.29 22.86,24.29 22.86,24.29 CD1.23
NRST: length 93.5
  Top Layer w0.254: 6.98,48.29 6.1,47.4 6.1,44.23 6.81,43.52 8.23,43.52 ; 6.98,48.29 4.95,50.33 4.95,79.15 7.62,81.82 29.97,81.82 31.88,79.92 47.12,79.92 U70.37 ; 6.98,48.29 8.22,48.29 8.33,48.41 ; REST1.2 2.39,42.07 7.87,42.07 8.23,42.43 8.23,43.52 ; 8.23,43.52 C5.2
PA2: length 35.9
  Top Layer w0.254: v1(54.99,24.67) 55.76,23.9 59.12,23.9
  Bottom Layer w0.254: U70.27 49.02,53.12 54.99,47.15 v1(54.99,24.67)
PA3: length 42.6
  Top Layer w0.254: v1(49.71,53.75) 49.71,54.47 U70.28 ; AB1.23 v1(57.02,18.7)
  Bottom Layer w0.254: v1(49.71,53.75) 55.68,47.78 55.68,24.64 57.02,23.29 v1(57.02,18.7)
PA6: length 65.4
  Bottom Layer w0.254: MOTORB1.3 73.39,27.7 74.42,28.73 74.42,30.89 73.91,31.4 60.45,31.4 59.31,32.55 59.31,47.76 51.82,55.25 51.82,66.07 50.93,66.96 47.88,66.96 47.24,66.33 47.24,64.17 48.13,63.28 U70.31
PA7: length 54.7
  Bottom Layer w0.254: U70.32 50.29,65.82 51.31,64.8 51.31,55.11 58.55,47.87 58.55,31.15 59.49,30.2 MOTORB1.4
PA11: length 99.6
  Top Layer w0.254: v1(29.59,45.63) 29.59,43.34 31.12,41.82 44.7,41.82 45.85,40.67 v1(45.85,30.89)
  Bottom Layer w0.254: U70.8 33.27,67.6 31.62,65.95 31.62,59.47 29.59,57.44 v1(29.59,45.63) ; v1(45.85,30.89) 45.85,15.26 49.72,11.39 67.77,11.39 71.45,7.7 MOTORA1.3
PA12: length 98.5
  Top Layer w0.254: v1(47.12,30.89) 47.12,42.7 45.45,44.37 31.36,44.37 v1(30.48,45.25)
  Bottom Layer w0.254: v1(30.48,45.25) 30.48,57.31 32.13,58.96 32.13,61.25 32.89,62.01 34.29,62.01 35.18,62.9 35.18,65.44 34.8,65.82 U70.9 ; MOTORA1.4 70.48,10.2 68.83,11.84 49.91,11.84 47.12,14.64 v1(47.12,30.89)
PB8: length 32.4
  Top Layer w0.254: v1(26.54,60.36) 26.54,52.74 27.56,51.72 v1(31.5,51.72)
  Bottom Layer w0.254: v1(26.54,60.36) 26.54,69.12 27.05,69.63 27.05,72.68 U54.3 ; U70.16 32.38,48.04 32.13,48.29 32.13,51.09 v1(31.5,51.72)
PB9: length 32
  Top Layer w0.254: v1(25.91,59.47) 25.91,52.61 27.56,50.96 31.12,50.96 v1(31.24,50.83)
  Bottom Layer w0.254: U54.4 25.65,59.72 v1(25.91,59.47) ; U70.17 32,45.5 31.24,46.26 v1(31.24,50.83)
PB10: length 69.7
  Top Layer w0.254: v1(28.57,44.61) 28.57,31.53 v1(29.34,30.77) ; U70.35 49.78,73.44 50.67,72.55 50.67,68.11 49.53,66.96 46.48,66.96 45.47,65.95 45.47,57.82 44.58,56.93 29.59,56.93 v1(28.57,55.91)
  Bottom Layer w0.254: U12.3 29.34,27.57 v1(29.34,30.77) ; v1(28.57,44.61) v1(28.57,55.91)
PB11: length 75.5
  Top Layer w0.254: U70.36 48.39,75.85 47.5,75.85 47.12,75.47 47.12,72.68 47.62,72.17 49.53,72.17 50.04,71.66 50.04,70.14 49.53,69.63 46.61,69.63 44.58,67.6 44.58,60.48 43.56,59.47 31.12,59.47 27.69,56.04 v1(27.69,55.79) ; v1(27.81,43.47) 28.07,43.21 28.07,31.02 28.45,30.64 v1(28.45,29.75)
  Bottom Layer w0.254: v1(28.45,29.75) 28.45,25.92 U12.4 ; v1(27.69,55.79) 27.69,43.59 v1(27.81,43.47)
$1N6371: length 7.1
  Top Layer w0.254: 66.78,47.05 C43.2 ; 66.78,47.05 U66.3 ; 66.78,47.05 66.78,43.98 L3.2
$1N6375: length 9.7
  Top Layer w0.254: v1(63.37,47.02) 64.76,47.02 C43.1 ; U66.1 v1(64.24,52.99)
  Bottom Layer w0.254: v1(63.37,47.02) 64.24,47.89 v1(64.24,52.99)
$1N6383: length 11.7
  Top Layer w0.254: RD2.1 RN2.1 68.05,64.04 U66.5
$1N6390: length 8
  Top Layer w0.254: U66.8 64.24,57.46 63.88,57.82 60.07,57.82 59.44,57.18 C45.1
$1N6393: length 13.4
  Top Layer w0.254: R37.2 60.45,64.41 60.45,63.66 61.09,63.03 65.79,63.03 66.78,62.03 U66.6
$1N6395: length 13.2
  Top Layer w0.254: R37.1 60.55,65.79 60.2,65.44 55.63,65.44 54.99,64.8 54.99,62.26 55.63,61.63 57.15,61.63 57.53,61.25 57.53,60.33 C46.2
$1N6398: length 15.1
  Top Layer w0.254: R38.2 57.02,63.15 58.04,62.14 64.26,62.14 65.51,60.89 U66.7

## Copper pours and planes (outline as drawn; the poured copper is in the pictures)
+12V on Top Layer: 56.77,52.1 56.77,51.47 57.78,50.45 62.61,50.45 62.99,50.83 62.99,52.48 62.23,53.25 57.91,53.25
+12V on Top Layer: 77.22,71.66 78.04,70.84 78.04,68.52 77.37,67.85 59.31,67.85 58.67,67.22 58.67,66.07 58.29,65.69 55.5,65.69 54.86,66.33 54.86,68.99 57.53,71.66
+12V on Bottom Layer: 57.15,51.41 57.98,50.58 61.34,50.58 62.23,51.47 62.23,52.74 61.64,53.33 59.51,53.33 58.93,53.91 58.93,67.34 58.04,68.23 56.01,68.23 55.25,67.47 55.25,53.25 57.08,51.41
GND on Top Layer: -4.95,94.78 81.91,94.78 81.91,-2.38 -4.95,-2.38
GND on Bottom Layer: -0.13,91.47 85.98,91.47 85.98,-6.44 -0.13,-6.44
VCC on Bottom Layer: 62.36,80.81 64.52,80.81 65.53,79.79 65.53,72.68 67.94,70.26 73.28,70.26 74.81,68.73 77.35,68.73 78.23,67.85 78.23,64.71 77.39,63.87 74.72,63.87 71.25,67.34 66.8,67.34 61.09,73.06 61.09,79.53

Small or netless copper shapes (teardrops, artwork), in the pictures only: 196 on Top Layer, 104 on Bottom Layer

## Text on the board
Top Layer: 2024.9.4 | 殷从容 / 刘屹楷 / 李圣卿 | 山东科技大学
Top Silkscreen Layer: GND | +5V | PB8 | PB9 | PA15 | PA10 | PA9 | PC13 | PB7 | - | + | ON | OFF
